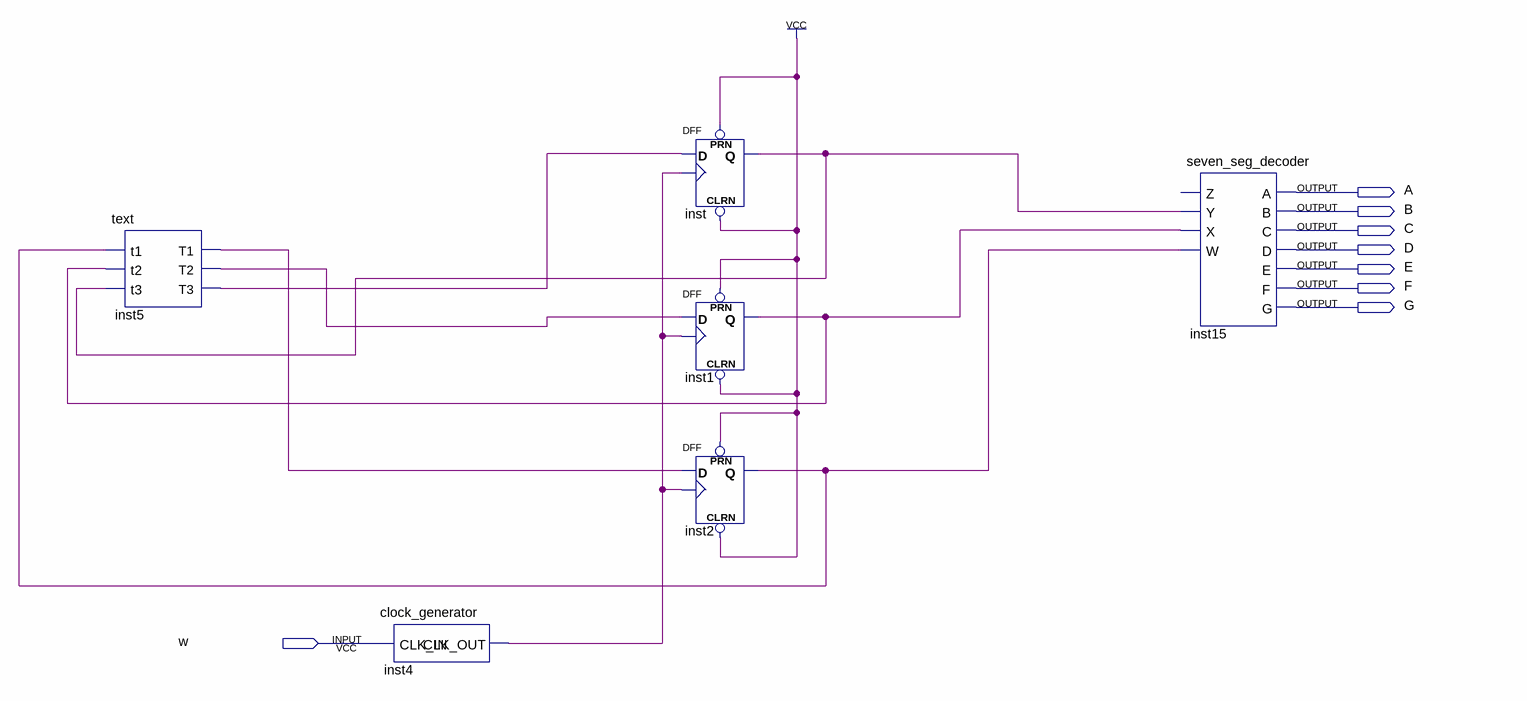
[diagram p0: schematic sheet]
// Quartus schematic try2.bdf as structural Verilog: 6 symbols, 8 pins
module try2 (
  input  w,
  output A,
  output B,
  output C,
  output D,
  output E,
  output F,
  output G
);

  wire inst1_q, inst2_q, inst4_clk_out, inst5_t1, inst5_t2, inst5_t3, inst_q;

  text inst5 (.t1(inst2_q), .t2(inst1_q), .t3(inst_q), .T1(inst5_t1), .T2(inst5_t2), .T3(inst5_t3));
  clock_generator inst4 (.CLK_IN(w), .CLK_OUT(inst4_clk_out));
  DFF inst (.CLRN(1'b1), .CLK(inst4_clk_out), .D(inst5_t3), .PRN(1'b1), .Q(inst_q));
  DFF inst1 (.CLRN(1'b1), .CLK(inst4_clk_out), .D(inst5_t2), .PRN(1'b1), .Q(inst1_q));
  DFF inst2 (.CLRN(1'b1), .CLK(inst4_clk_out), .D(inst5_t1), .PRN(1'b1), .Q(inst2_q));
  seven_seg_decoder inst15 (
    .Y(inst_q), .X(inst1_q), .W(inst2_q), .A(A), .B(B), .C(C), .D(D), .E(E), .F(F), .G(G));  // open: Z
endmodule
